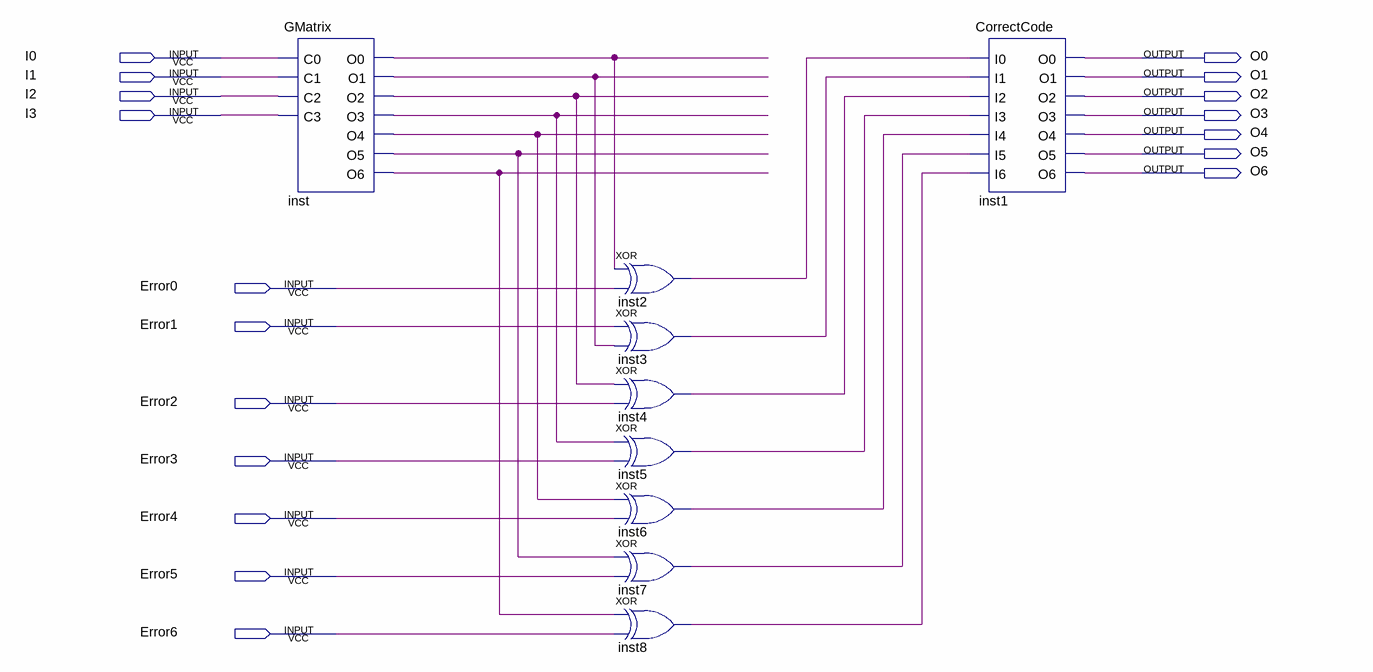
[diagram p0: schematic sheet]
// Quartus schematic testHamming.bdf as structural Verilog: 9 symbols, 18 pins
module testHamming (
  input  I0,
  input  I1,
  input  I2,
  input  I3,
  input  Error0,
  input  Error1,
  input  Error2,
  input  Error3,
  input  Error4,
  input  Error5,
  input  Error6,
  output O0,
  output O1,
  output O2,
  output O3,
  output O4,
  output O5,
  output O6
);

  wire inst2_out, inst3_out, inst4_out, inst5_out, inst6_out, inst7_out, inst8_out, inst_o0, inst_o1,
       inst_o2, inst_o3, inst_o4, inst_o5, inst_o6;

  GMatrix inst (
    .C0(I0), .C1(I1), .C2(I2), .C3(I3), .O0(inst_o0), .O1(inst_o1), .O2(inst_o2), .O3(inst_o3), .O4(inst_o4),
    .O5(inst_o5), .O6(inst_o6));
  xor inst2 (inst2_out, inst_o0, Error0);
  xor inst3 (inst3_out, Error1, inst_o1);
  xor inst4 (inst4_out, inst_o2, Error2);
  xor inst5 (inst5_out, inst_o3, Error3);
  xor inst6 (inst6_out, inst_o4, Error4);
  xor inst7 (inst7_out, inst_o5, Error5);
  xor inst8 (inst8_out, inst_o6, Error6);
  CorrectCode inst1 (
    .I0(inst2_out), .I1(inst3_out), .I2(inst4_out), .I3(inst5_out), .I4(inst6_out), .I5(inst7_out),
    .I6(inst8_out), .O0(O0), .O1(O1), .O2(O2), .O3(O3), .O4(O4), .O5(O5), .O6(O6));
endmodule
